# Altium project UHF_Protoboard.PrjPCB
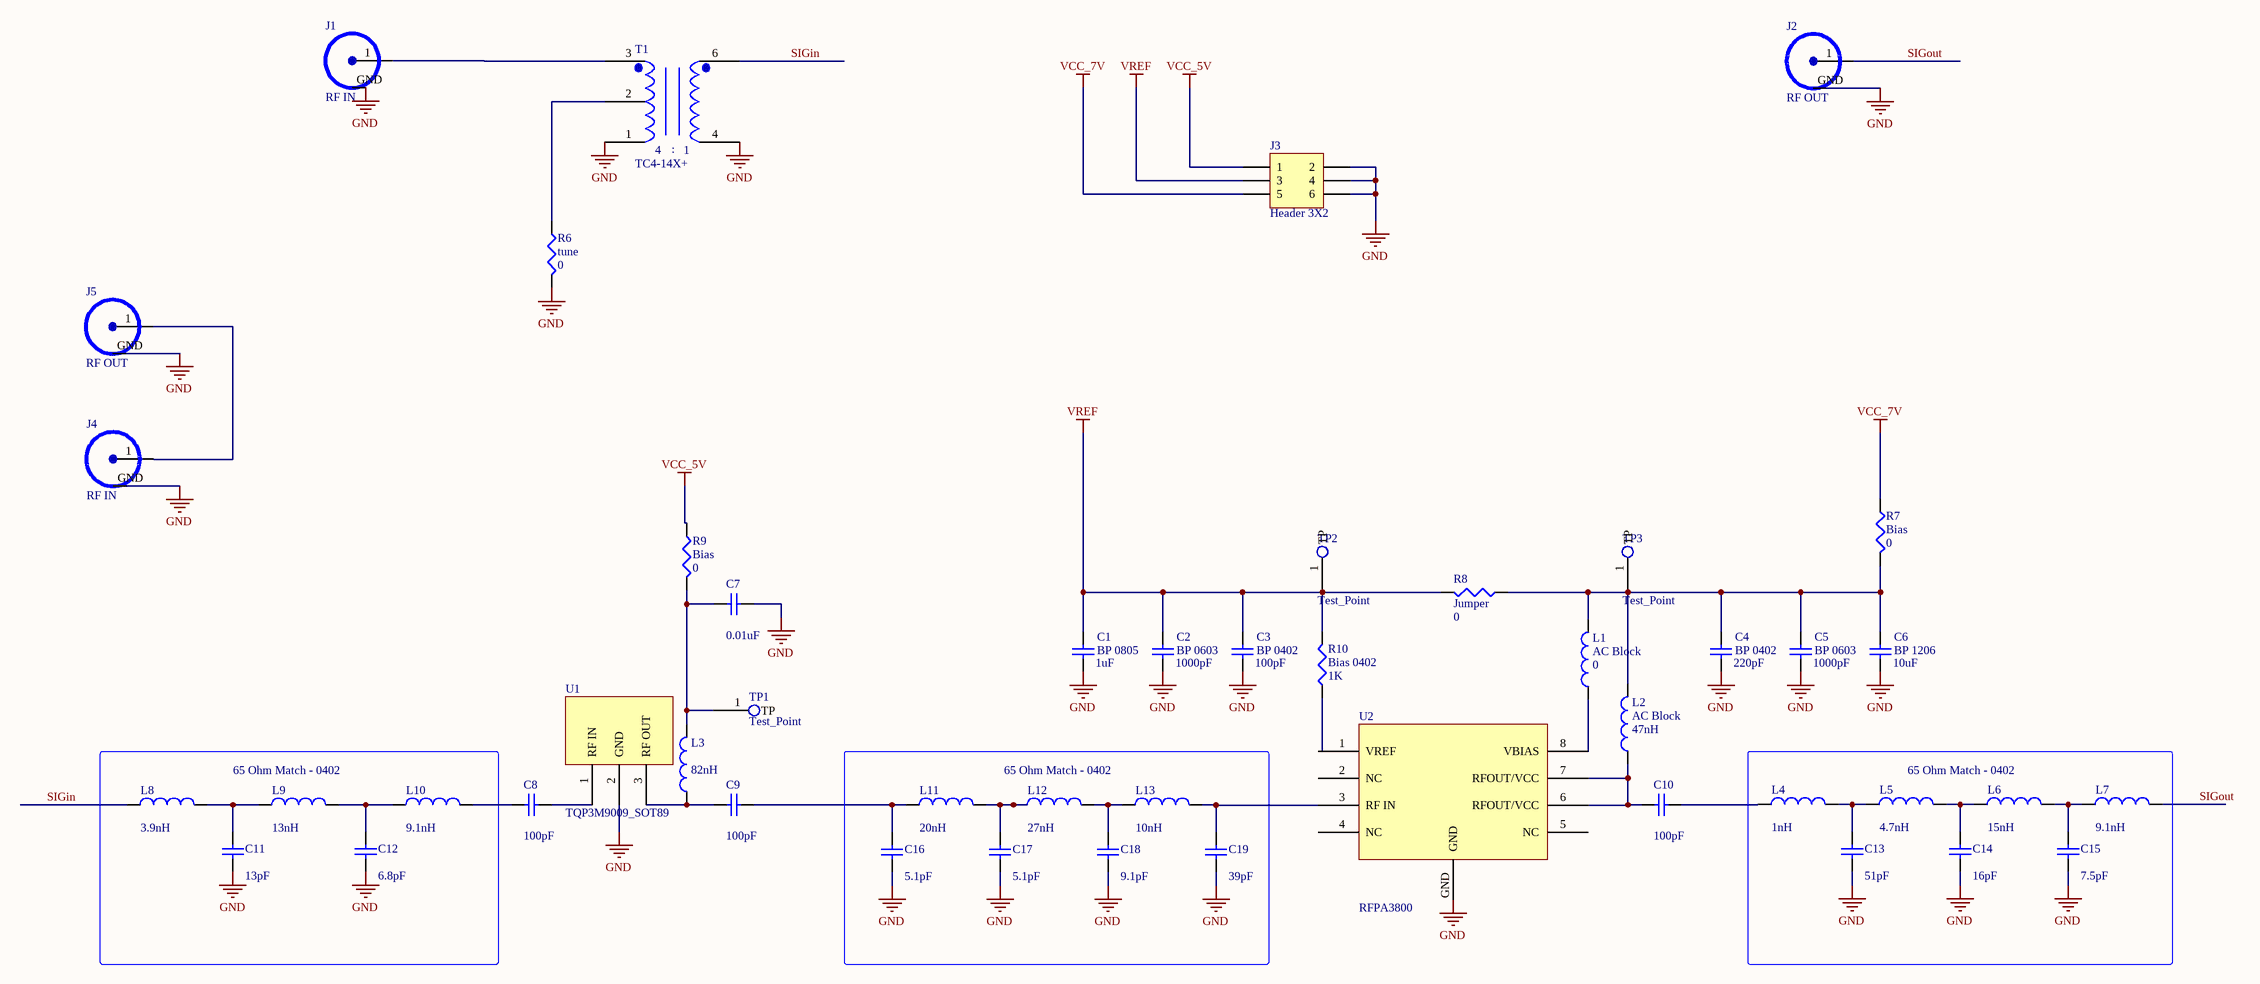
[diagram p0: RF_Protoboard.SchDoc]
1 sheet, 48 parts. Net scope: global (net labels, ports and power ports of the same name join across sheets).
Board file: RF_Protoboard.PcbDoc

## Sheet RF_Protoboard.SchDoc
size C

### Parts
C1  BP 0805  value 1uF  [0805_SMT]
C2  BP 0603  value 1000pF  [0603_SMT]
C3  BP 0402  value 100pF  [0402_SMT]
C4  BP 0402  value 220pF  [0402_SMT]
C5  BP 0603  value 1000pF  [0603_SMT]
C6  BP 1206  value 10uF  [0805_SMT]
C7  value 0.01uF  [0402_SMT]  (hidden comment: Cap)
C8  value 100pF  [0402_SMT]  (hidden comment: Cap)
C9  value 100pF  [0402_SMT]  (hidden comment: Cap)
C10  value 100pF  [0402_SMT]  (hidden comment: Cap)
C11  value 13pF  [0402_SMT]  (hidden comment: Cap)
C12  value 6.8pF  [0402_SMT]  (hidden comment: Cap)
C13  value 51pF  [0402_SMT]  (hidden comment: Cap)
C14  value 16pF  [0402_SMT]  (hidden comment: Cap)
C15  value 7.5pF  [0402_SMT]  (hidden comment: Cap)
C16  value 5.1pF  [0402_SMT]  (hidden comment: Cap)
C17  value 5.1pF  [0402_SMT]  (hidden comment: Cap)
C18  value 9.1pF  [0402_SMT]  (hidden comment: Cap)
C19  value 39pF  [0402_SMT]  (hidden comment: Cap)
J1  RF IN  [SMA_Edge_Launch]
J2  RF OUT  [SMA_Edge_Launch]
J3  Header 3X2  [HDR2X3]
J4  RF IN  [SMA_Edge_Launch]
J5  RF OUT  [SMA_Edge_Launch]
L1  AC Block  value 0  [0402_SMT]
L2  AC Block  value 47nH  [0402_SMT]
L3  value 82nH  [0402_SMT]  (hidden comment: Inductor)
L4  value 1nH  [0402_SMT]  (hidden comment: Inductor)
L5  value 4.7nH  [0402_SMT]  (hidden comment: Inductor)
L6  value 15nH  [0402_SMT]  (hidden comment: Inductor)
L7  value 9.1nH  [0402_SMT]  (hidden comment: Inductor)
L8  value 3.9nH  [0402_SMT]  (hidden comment: Inductor)
L9  value 13nH  [0402_SMT]  (hidden comment: Inductor)
L10  value 9.1nH  [0402_SMT]  (hidden comment: Inductor)
L11  value 20nH  [0402_SMT]  (hidden comment: Inductor)
L12  value 27nH  [0402_SMT]  (hidden comment: Inductor)
L13  value 10nH  [0402_SMT]  (hidden comment: Inductor)
R6  tune  value 0  [0402_SMT]
R7  Bias  value 0  [0402_SMT]
R8  Jumper  value 0  [0402_SMT]
R9  Bias  value 0  [0402_SMT]
R10  Bias 0402  value 1K  [0402_SMT]
T1  TC4-14X+  [AT224-1]
TP1  Test_Point  [Test_Point]
TP2  Test_Point  [Test_Point]
TP3  Test_Point  [Test_Point]
U1  TQP3M9009_SOT89  [TQP3M9009_SOT-89]
U2  RFPA3800  [RFPA3800_SOIC-8]

### Blocks framed on the sheet
65 Ohm Match - 0402: C11 C12 L8-L10
65 Ohm Match - 0402: C16-C19 L11-L13
65 Ohm Match - 0402: C13-C15 L4-L7

### Nets
GND: C1.1 C2.1 C3.1 C4.1 C5.1 C6.1 C7.2 C11.1 C12.1 C13.1 C14.1 C15.1 C16.1 C17.1 C18.1 C19.1 J1.GND J2.GND J3.2 J3.4 J3.6 J4.GND J5.GND R6.2 T1.1(S) T1.4(P) U1.2(GND) U2.GND
VCC_5V: J3.1 R9.1
VCC_7V: J3.5 R7.1
VREF: C1.2 C2.2 C3.2 J3.3 R8.2 R10.2 TP2.1(TP)
SIGin: L8.1 T1.6(P_DOT)
SIGout: J2.1(SIG) L7.2
NetC4_2: C4.2 C5.2 C6.2 L1.2 L2.2 R7.2 R8.1 TP3.1(TP)
NetC7_1: C7.1 L3.2 R9.2 TP1.1(TP)
NetC8_1: C8.1 L10.2
NetC8_2: C8.2 U1.1(RF_IN)
NetC9_1: C9.1 L3.1 U1.3(RF_OUT)
NetC9_2: C9.2 C16.2 L11.1
NetC10_1: C10.1 L2.1 U2.6(RFOUT/VCC) U2.7(RFOUT/VCC)
NetC10_2: C10.2 L4.1
NetC11_2: C11.2 L8.2 L9.1
NetC12_2: C12.2 L9.2 L10.1
NetC13_2: C13.2 L4.2 L5.1
NetC14_2: C14.2 L5.2 L6.1
NetC15_2: C15.2 L6.2 L7.1
NetC17_2: C17.2 L11.2 L12.1
NetC18_2: C18.2 L12.2 L13.1
NetC19_2: C19.2 L13.2 U2.3(RF_IN)
NetJ1_1: J1.1(SIG) T1.3(S_DOT)
NetJ4_1: J4.1(SIG) J5.1(SIG)
NetL1_1: L1.1 U2.8(VBIAS)
NetR6_1: R6.1 T1.2(S_CT)
NetR10_1: R10.1 U2.1(VREF)

Not connected (* = marked no-connect by the designer): U2 2(NC) 4(NC) 5(NC)

### Notes on the sheet
- (in symbol TC4-14+) :

### Library data of the parts
C1-C10 C12-C19 = Cap: Capacitor; Published: 8-Jun-2000; LatestRevisionDate: 17-Jul-2002; LatestRevisionNote: Re-released for DXP Platform.; PackageReference: RAD-0.3; Publisher: Altium Limited; PackageDescription: Radial Cap, Thru-Hole; 2 Leads; 0.3 in Pin Spacing; Supplier 1: Mouser
  C1: Supplier Part Number 1: 81-GRM21BR71H105KA2L
  C2 C5: Supplier Part Number 1: 81-GRM39X102J50D
  C3 C8-C10: Supplier Part Number 1: 81-GRM1555C1H101GA1D
  C4: Supplier Part Number 1: 81-GRM1555C1H221GA1J
  C6: Supplier Part Number 1: 81-GRM31CR61H106KA2L
  C7: Supplier Part Number 1: 81-GRM155R71H103KA8D
  C12: Supplier Part Number 1: 81-GRM1555C1H6R8CA1D
  C13: Supplier Part Number 1: 81-GRM1555C1H510GA1D
  C14: Supplier Part Number 1: 81-GRM1555C1H160JA1D
  C15: Supplier Part Number 1: 81-GJM1555C1H7R5DB1D
  C16 C17: Supplier Part Number 1: 81-GJM1555C1H5R1CB01
  C18: Supplier Part Number 1: 81-GRM1555C1H9R1WA1D
  C19: Supplier Part Number 1: 81-GRM1555C1H390GA1D
C11 = Cap: Capacitor; Lead Time: 10 weeks; Published: 8-Jun-2000; LatestRevisionDate: 17-Jul-2002; LatestRevisionNote: Re-released for DXP Platform.; PackageReference: RAD-0.3; Publisher: Altium Limited; PackageDescription: Radial Cap, Thru-Hole; 2 Leads; 0.3 in Pin Spacing; Supplier 1: Mouser; Supplier Part Number 1: 81-GRM1555C1H130JA1D
J1 J2 J4 J5 = SMA-Edge-Launch: Edge-Launch SMA Female; Supplier 1: Mouser; Supplier Part Number 1: 523-901-10003
J3 = Header 3X2: Header, 3-Pin, Dual row; LatestRevisionDate: 17-Jul-2002; LatestRevisionNote: Re-released for DXP Platform.; Publisher: Altium Limited; Supplier 1: Mouser; Supplier Part Number 1: 855-M20-9980345
L1-L13 = Inductor: Code_IEC: 1005; Published: 8-Jun-2000; LatestRevisionDate: 29-May-2009; LatestRevisionNote: IPC-7351 Footprint Added.; PackageReference: 0402-A; Publisher: Altium Limited; PackageDescription: Chip Inductor; Code_JEITA: 0402; Supplier 1: Mouser
  L1: Supplier Part Number 1: 660-RK73Z1ETTP
  L2: Supplier Part Number 1: 81-LQW15AN47NJ00D
  L3: Supplier Part Number 1: 81-LQW15AN82NJ00D
  L4: Supplier Part Number 1: 81-LQP15MN1N0B02D
  L5: Supplier Part Number 1: 81-LQP15MN4N7B02D
  L6: Supplier Part Number 1: 81-LQP15MN15NG02D
  L7 L10: Supplier Part Number 1: 81-LQP15MN9N1B02D
  L8: Supplier Part Number 1: 81-LQP15MN3N9W02D
  L9: Supplier Part Number 1: 81-LQW15AN13NG00D
  L11: Supplier Part Number 1: 81-LQW15AN20NH00D
  L12: Supplier Part Number 1: 81-LQP15MN27NG02D
  L13: Supplier Part Number 1: 81-LQP15MN10NG02D
R6-R10 = Res3: Resistor; Published: 8-Jun-2000; LatestRevisionDate: 29-May-2009; LatestRevisionNote: IPC-7351 Footprint Added.; PackageReference: J1-0603; Publisher: Altium Limited; PackageDescription: Chip Resistor; Supplier 1: Mouser
  R6-R9: Supplier Part Number 1: 660-RK73Z1ETTP
  R10: Supplier Part Number 1: 754-RR0510P-102D
T1 = TC4-14+: Mini-Circuits Type A Transformer, 4:1 Ohm, CT; Manufacturer: Mini-Circuits; Supplier 1: Mini-Circuits; Supplier Part Number 1: TC4-14X+
TP1-TP3 = Test_Point: Test Point; Supplier 1: Mouser; Supplier Part Number 1: 855-S1751-46R
U1 = TQP3M9009_SOT89: Triquint TQP3M9009 Power Amplifier; Supplier 1: Mouser; Supplier Part Number 1: 772-TQP3M9009
U2 = RFPA3800: RFMD RFPA3800 Power Amplifier; Manufacturer: RFMD; Supplier 1: RFMD; Supplier Part Number 1: RFPA3800